# Altium schematic sheet COTS_Altimeter.SchDoc
size A3
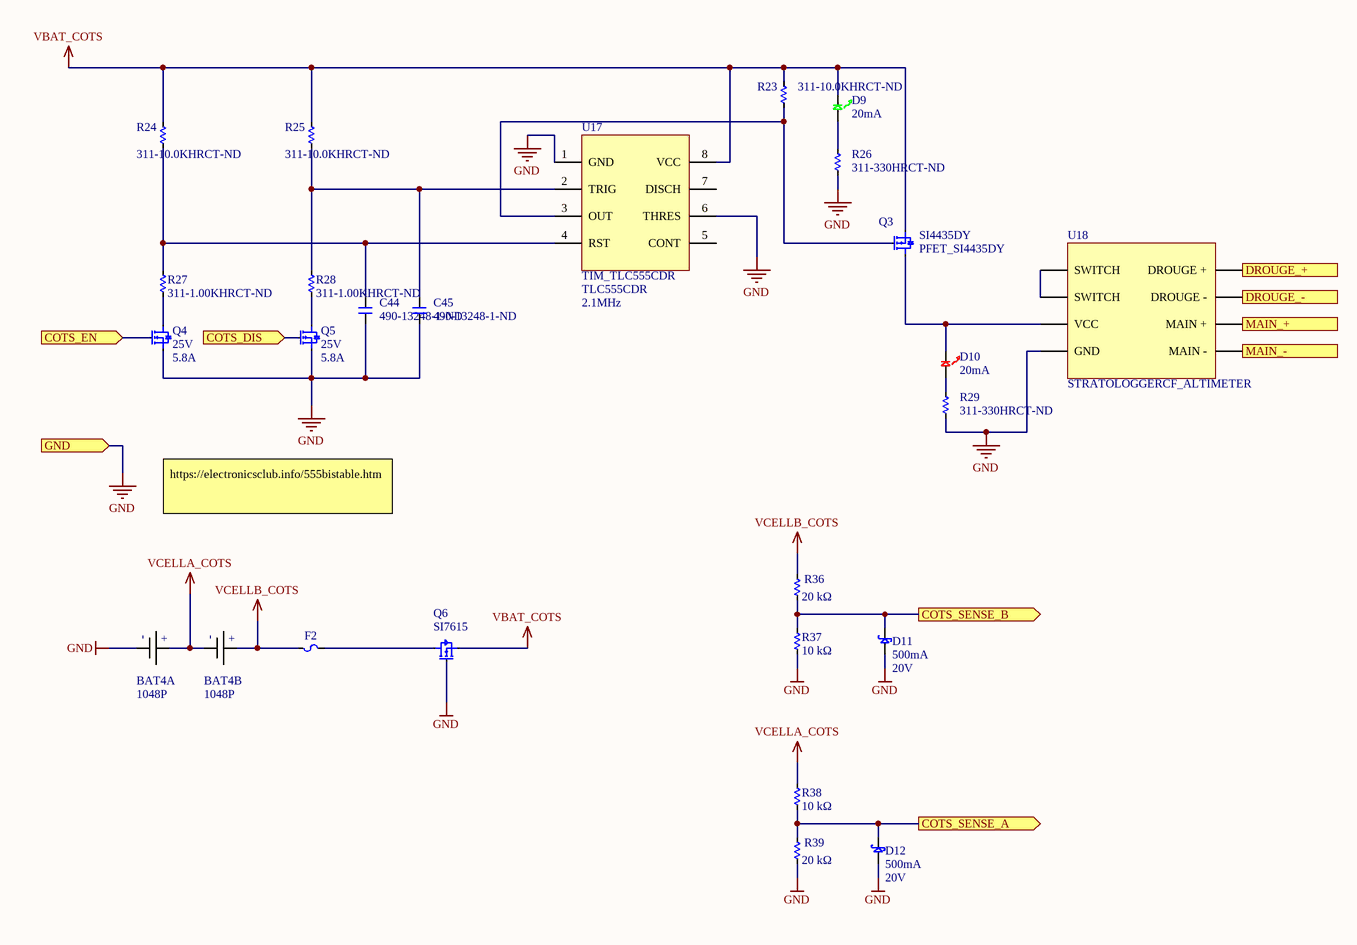
[diagram p0: COTS_Altimeter.SchDoc]

## Parts
BAT4  Manufacturer Part Number: 1048P  [BATT_18650_KEYSTONE_1048]  (hidden comment: BATT_Clip_Li-Ion_2x)  (parts A,B of 2)
C44  490-13248-1-ND  [C0603]
C45  490-13248-1-ND  [C0603]
D9  Current - Test: 20mA  [0805_Diode]  (hidden comment: LED_LY971)
D10  Current - Test: 20mA  [0805_Diode]  (hidden comment: LED_LY974)
D11  Current - Average Rectified (Io): 500mA  Voltage - DC Reverse (Vr) (Max): 20V  [SOD123]  (hidden comment: SCHOTTKY_MBR0520L)
D12  Current - Average Rectified (Io): 500mA  Voltage - DC Reverse (Vr) (Max): 20V  [SOD123]  (hidden comment: SCHOTTKY_MBR0520L)
F2  __template_fuse  [R1206]  (value not drawn)
Q3  PFET_SI4435DY  Manufacturer Part Number: SI4435DY  [8SOIC300]
Q4  Drain to Source Voltage (Vdss): 25V  Current - Continuous Drain (Id) @ 25° C: 5.8A  [3SOT23]  (hidden comment: NFET_IRFML8244TRPBF)
Q5  Drain to Source Voltage (Vdss): 25V  Current - Continuous Drain (Id) @ 25° C: 5.8A  [3SOT23]  (hidden comment: NFET_IRFML8244TRPBF)
Q6  SI7615  [POWERPAK_1212-8_SINGLE]
R23  311-10.0KHRCT-ND  [R0603]
R24  311-10.0KHRCT-ND  [R0603]
R25  311-10.0KHRCT-ND  [R0603]
R26  311-330HRCT-ND  [R0603]
R27  311-1.00KHRCT-ND  [R0603]
R28  311-1.00KHRCT-ND  [R0603]
R29  311-330HRCT-ND  [R0603]
R36  Resistance: 20 kΩ  [R0603]  (hidden comment: 311-20.0KHRCT-ND)
R37  Resistance: 10 kΩ  [R0603]  (hidden comment: 311-10.0KHRCT-ND)
R38  Resistance: 10 kΩ  [R0603]  (hidden comment: 311-10.0KHRCT-ND)
R39  Resistance: 20 kΩ  [R0603]  (hidden comment: 311-20.0KHRCT-ND)
U17  TIM_TLC555CDR  Manufacturer Part Number: TLC555CDR  Frequency: 2.1MHz  [8SOIC390]
U18  STRATOLOGGERCF_ALTIMETER  [STRATOLOGGER_ALTIMETER]

## Ports
COTS_DIS (in), COTS_EN (in), COTS_SENSE_A (out), COTS_SENSE_B (out), DROUGE_+ (out), DROUGE_- (out), GND (in), MAIN_+ (out), MAIN_- (out)

## Nets
GND: BAT4.CELL1- C44.2 C45.2 D11.1 D12.1 Q4.2 Q5.2 Q6.4 R26.1 R29.1 R37.1 R39.1 U17.1(GND) U17.6(THRES) U18.5(GND) ; port GND
VBAT_COTS: D9.1 Q3.1,2,3 Q6.1 R23.2 R24.2 R25.2 U17.8(VCC)
VCELLA_COTS: BAT4.CELL1+ BAT4.CELL2- R38.2
VCELLB_COTS: BAT4.CELL2+ F2.1 R36.2
COTS_DIS: Q5.1 ; port COTS_DIS
COTS_EN: Q4.1 ; port COTS_EN
COTS_SENSE_A: D12.2 R38.1 R39.2 ; port COTS_SENSE_A
COTS_SENSE_B: D11.2 R36.1 R37.2 ; port COTS_SENSE_B
DROUGE_+: U18.4(DROUGE_+) ; port DROUGE_+
DROUGE_-: U18.3(DROUGE_-) ; port DROUGE_-
MAIN_+: U18.2(MAIN_+) ; port MAIN_+
MAIN_-: U18.1(MAIN_-) ; port MAIN_-
NetC44_1: C44.1 R24.1 R27.2 U17.4(RST)
NetC45_1: C45.1 R25.1 R28.2 U17.2(TRIG)
NetD9_2: D9.2 R26.2
NetD10_1: D10.1 Q3.5,6,7,8 U18.6(VCC)
NetD10_2: D10.2 R29.2
NetF2_2: F2.2 Q6.5
NetQ3_4: Q3.4 R23.1 U17.3(OUT)
NetQ4_3: Q4.3 R27.1
NetQ5_3: Q5.3 R28.1
NetU18_7: U18.7(SWITCH) U18.8(SWITCH)

Not connected (* = marked no-connect by the designer): U17 5(CONT) 7(DISCH)

## Notes on the sheet
- https://electronicsclub.info/555bistable.htm
- (in symbol CMP-030-0028-1, part A) +
- (in symbol CMP-030-0028-1, part B) +

## Library data of the parts
BAT4 = CMP-030-0028-1: Dual Lithium Ion Cell Holder; Manufacturer: Keystone Electronics; Number of Cells: 2; Battery Type, Function: Cylindrical, Holder; Battery Cell Size: 18650; Style: Holder (Open); ComponentLink1URL: http://www.keyelco.com/product-pdf.cfm?p=13959; Battery Series: -; RoHS: RoHS Compliant; Height Above Board: 0.585" (14.86mm); Design Item ID: BATT_Clip_Li-Ion_2x; Mounting Type: PCB, Surface Mount; Termination Style: SMD (SMT) Tab; Source: connector.SchLib; Stock 1: 759; Pricing 1: 1=4.81, 10=4.007, 50=3.506, 100=3.339, 250=2.92164, 500=2.83816, 1000=2.42078, 2500=2.25382, 5000=2.24047 (USD); ComponentLink1Description: http://www.keyelco.com/product-pdf.cfm?p=13959; Operating Temperature: -50°C ~ 145°C
C44 C45 = CMP-119-0071-1: CAP CER 10UF 35V X5R 0603 20%; Manufacturer: Murata Electronics North America; Capacitance - pF (Machine readable): #NAME?; Capacitance (shorthand): 10µF; Rated Voltage: 35V; Dielectric: X5R
D9 = CMP-033-0000-1: LED 0805 GREEN 20MA; Manufacturer Part Number: LG R971-KN-1; Manufacturer: OSRAM Opto Semiconductors Inc; Lens Color: White; Wavelength - Peak: 572nm; Lens Style/Size: Rectangle with Flat Top, 1.30mm x 1.25mm; Voltage - Forward (Vf) (Typ): 2.2V; Lens Transparency: Diffused; Wavelength - Dominant: 570nm; Millicandela Rating: 26.05mcd; Viewing Angle: 160°; Source: diode.SchLib; RoHS: RoHS Compliant; ComponentLink1URL: http://www.osram-os.com/Graphics/XPic9/00078860_0.pdf; Mounting Type: Surface Mount; ComponentLink1Description: http://www.osram-os.com/Graphics/XPic9/00078860_0.pdf; Packaging: Cut Tape (CT); Supplier Device Package: *; Package / Case: 0805 (2012 Metric); Design Item ID: LED_LY971; Size / Dimension: 2.00mm L x 1.25mm W; Pricing 1: 1=0.08, 10=0.069, 100=0.0548, 250=0.04796, 500=0.04384 (USD); Stock 1: 89733; Height (Max): 0.80mm; Color: Green
D10 = CMP-033-0001-1: LED 0805 RED 20MA; Manufacturer Part Number: LH R974-LP-1; Manufacturer: OSRAM Opto Semiconductors Inc; Millicandela Rating: 41mcd; Lens Style/Size: Rectangle with Flat Top, 1.30mm x 1.25mm; Wavelength - Peak: 660nm; Lens Transparency: Diffused; Wavelength - Dominant: 645nm; Viewing Angle: 160°; Voltage - Forward (Vf) (Typ): 1.8V; Lens Color: White; Mounting Type: Surface Mount; ComponentLink1Description: http://www.osram-os.com/Graphics/XPic8/00078869_0.pdf; Pricing 1: 1=0.08, 10=0.07, 100=0.0559, 250=0.04892, 500=0.04472 (USD); Packaging: Cut Tape (CT); Size / Dimension: 2.00mm L x 1.25mm W; Design Item ID: LED_LY974; Stock 1: 66379; Package / Case: 0805 (2012 Metric); ComponentLink1URL: http://www.osram-os.com/Graphics/XPic8/00078869_0.pdf; RoHS: RoHS Compliant; Color: Red; Supplier Device Package: *; Height (Max): 0.80mm; Source: diode.SchLib
D11 D12 = CMP-033-0037-1: DIODE SCHOTTKY 0.5A 20V SOD-123; Manufacturer: Fairchild Semiconductor; Speed: Fast Recovery =< 500ns, > 200mA (Io); Current - Reverse Leakage @ Vr: 250µA @ 20V; Voltage - Forward (Vf) (Max) @ If: 385mV @ 500mA; Manufacturer Part Number: MBR0520L; RoHS: RoHS Compliant; Stock 1: 217232; Pricing 1: 1=0.63, 10=0.43, 100=0.2024, 250=0.1442, 500=0.11006, 750=0.08603, 1000=0.0759 (USD); Diode Type: Schottky; Reverse Recovery Time (trr): -; Capacitance @ Vr, F: -; Mounting Type: Surface Mount; Package / Case: SOD-123; Supplier Device Package: SOD-123; Packaging: Cut Tape (CT); ComponentLink1URL: http://www.fairchildsemi.com/ds/MB/MBR0520L.pdf; ComponentLink1Description: Datasheet; Design Item ID: SCHOTTKY_MBR0520L; Source: diode.SchLib
F2 = CMP-035-0003-1: Source: fuse.SchLib; Design Item ID: __template_fuse
Q3 = CMP-078-0013-1: MOSFET P-CH 30V 8.8A; Manufacturer: Fairchild Semiconductor; Drain to Source Resistance: 20mR; Current Rating: -8.8A; Fall Time: 25ns; Number of Elements: 1; Nominal Vgs: -1.7V; Turn-Off Delay Time: 42ns; Voltage Rating (DC): -30V; Max Power Dissipation: 2.5W; Rise Time: 13.5ns; Gate to Source Voltage (Vgs): 20V; Input Capacitance: 1.604nF; Element Configuration: Single; Turn-On Delay Time: 16ns; Length: 4.9mm; Case/Package: SOIC; Continuous Drain Current (ID): 8.8A; Lead Free: Lead Free; Stock 1: 5038; Width: 3.9mm; Pricing 1: 1=0.99, 10=0.884, 100=0.6893, 500=0.5694, 1000=0.4495 (USD); ComponentLink5Description: https://datasheet.ciiva.com/16772/si4435dy-16772219.pdf; ComponentLink1Description: https://datasheet.ciiva.com/4450/si4435dy-100561-4450691.pdf; ComponentLink7Description: https://datasheet.ciiva.com/6374/si4435dy-6374703.pdf; Threshold Voltage: -1.7V; Max Operating Temperature: 175°C; Package Quantity: 1; Packaging: Tape and Reel; Height: 1.57mm; ComponentLink3Description: https://datasheet.ciiva.com/26252/si4435dy-26252714.pdf; ComponentLink7URL: https://datasheet.ciiva.com/6374/si4435dy-6374703.pdf; Drain to Source Voltage (Vdss): 30V; Dual Supply Voltage: -30V; ComponentLink2Description: https://datasheet.ciiva.com/22682/256483-22682026.pdf; Radiation Hardening: No; Rds On Max: 20mR; REACH SVHC: No SVHC; ComponentLink3URL: https://datasheet.ciiva.com/26252/si4435dy-26252714.pdf; ComponentLink6URL: https://datasheet.ciiva.com/6374/si4435dy-6374700.pdf; ComponentLink4Description: https://datasheet.ciiva.com/11175/si4435dy-11175899.pdf; ComponentLink4URL: https://datasheet.ciiva.com/11175/si4435dy-11175899.pdf; ComponentLink2URL: https://datasheet.ciiva.com/22682/256483-22682026.pdf; Source: transistor_fet.SchLib; ComponentLink6Description: https://datasheet.ciiva.com/6374/si4435dy-6374700.pdf; Number of Pins: 8; ComponentLink5URL: https://datasheet.ciiva.com/16772/si4435dy-16772219.pdf; Drain to Source Breakdown Voltage: -30V; Power Dissipation: 2.5W; Mount: Surface Mount; ComponentLink1URL: https://datasheet.ciiva.com/4450/si4435dy-100561-4450691.pdf; Termination: SMD/SMT; Design Item ID: PFET_SI4435DY; Min Operating Temperature: -55°C
Q4 Q5 = CMP-078-0046-1: MOSFET N-CH 25V 5.8A SOT23; Manufacturer: International Rectifier; FET Type: MOSFET N-Channel, Metal Oxide; FET Feature: Logic Level Gate; Rds On (Max) @ Id, Vgs: 24 mOhm @ 5.8A, 10V; Vgs(th) (Max) @ Id: 2.35V @ 10µA; Gate Charge (Qg) @ Vgs: 5.4nC @ 10V; Input Capacitance (Ciss) @ Vds: 430pF @ 10V; Power - Max: 1.25W; Manufacturer Part Number: IRFML8244TRPBF; RoHS: RoHS Compliant; Stock 1: 13542; Pricing 1: 1=0.41, 10=0.23, 100=0.1491, 250=0.13548, 500=0.1219, 1000=0.11411 (USD); Mounting Type: Surface Mount; Package / Case: TO-236-3, SC-59, SOT-23-3; Supplier Device Package: SOT-23; Packaging: Cut Tape (CT); ComponentLink1URL: http://www.irf.com/product-info/datasheets/data/irfml8244pbf.pdf; ComponentLink1Description: Datasheet; Design Item ID: NFET_IRFML8244TRPBF; Source: transistor_fet.SchLib
Q6 = CMP-078-0043-2: MOSFET P-CH 20V 35A PPK; Manufacturer: Vishay Siliconix; Manufacturer Part Number: SI7615ADN-T1-GE3; FET Type: MOSFET P-Channel, Metal Oxide; FET Feature: Standard; Current - Continuous Drain (Id) @ 25°C: 35A (Tc); Rds On (Max) @ Id, Vgs: 4.4 mOhm @ 20A, 10V; Vgs(th) (Max) @ Id: 1.5V @ 250µA; Gate Charge (Qg) @ Vgs: 183nC @ 10V; Input Capacitance (Ciss) @ Vds: 5590pF @ 10V; Power - Max: 52W; RoHS: RoHS Compliant; Stock 1: 98451; Pricing 1: 1=0.73, 10=0.646, 25=0.6068, 100=0.4951, 250=0.45988, 500=0.3914, 1000=0.31312 (USD); Packaging: Cut Tape (CT); Part Status: Active; Drain to Source Voltage (Vdss): 20V; Operating Temperature: -55°C ~ 150°C (TJ); Mounting Type: Surface Mount; Package / Case: PowerPAK® 1212-8; Supplier Device Package: PowerPAK® 1212-8; ComponentLink1URL: http://www.vishay.com/docs/62667/si7615adn.pdf; ComponentLink1Description: http://www.vishay.com/docs/62667/si7615adn.pdf; Source: transistor_fet.SchLib; Design Item ID: PFET_SI7615ADN-T1
R23-R25 = CMP-126-0273-2: RES SMD 10K OHM 1% 1/10W 0603; Manufacturer Part Number: RC0603FR-0710KL; Manufacturer: Yageo; Power (Watts): 0.1W, 1/10W; Temperature Coefficient: ±100ppm/°C; Resistance: 10 kΩ; Resistance (Sortable): 10000; Tolerance: ±1%; Operating Temperature: -55°C ~ 155°C; Datasheets: http://www.yageo.com/documents/recent/PYu-RC_Group_51_RoHS_L_9.pdf; Image: //media.digikey.com/Renders/Yageo%20Renders/0603-(1608-Metric).jpg
R26 R29 = CMP-126-0120-2: RES SMD 330 OHM 1% 1/10W 0603; Manufacturer: Yageo; Manufacturer Part Number: RC0603FR-07330RL; Temperature Coefficient: ±100ppm/°C; Resistance (Sortable): 330; Resistance: 330 Ω; Power (Watts): 0.1W, 1/10W; Tolerance: ±1%; Datasheets: http://www.yageo.com/documents/recent/PYu-RC_Group_51_RoHS_L_9.pdf; Operating Temperature: -55°C ~ 155°C; Image: //media.digikey.com/Renders/Yageo%20Renders/0603-(1608-Metric).jpg
R27 R28 = CMP-126-0172-2: RES SMD 1K OHM 1% 1/10W 0603; Manufacturer: Yageo; Manufacturer Part Number: RC0603FR-071KL; Power (Watts): 0.1W, 1/10W; Resistance (Sortable): 1000; Resistance: 1 kΩ; Temperature Coefficient: ±100ppm/°C; Image: //media.digikey.com/Renders/Yageo%20Renders/0603-(1608-Metric).jpg; Operating Temperature: -55°C ~ 155°C; Tolerance: ±1%; Datasheets: http://www.yageo.com/documents/recent/PYu-RC_Group_51_RoHS_L_9.pdf
R36 R39 = CMP-126-0304-2: RES SMD 20K OHM 1% 1/10W 0603; Manufacturer Part Number: RC0603FR-0720KL; Manufacturer: Yageo; Resistance (Sortable): 20000; Power (Watts): 0.1W, 1/10W; Temperature Coefficient: ±100ppm/°C; Datasheets: http://www.yageo.com/documents/recent/PYu-RC_Group_51_RoHS_L_9.pdf; Image: //media.digikey.com/Renders/Yageo%20Renders/0603-(1608-Metric).jpg; Tolerance: ±1%; Operating Temperature: -55°C ~ 155°C
R37 R38 = CMP-126-0273-2: RES SMD 10K OHM 1% 1/10W 0603; Manufacturer Part Number: RC0603FR-0710KL; Manufacturer: Yageo; Resistance (Sortable): 10000; Power (Watts): 0.1W, 1/10W; Temperature Coefficient: ±100ppm/°C; Datasheets: http://www.yageo.com/documents/recent/PYu-RC_Group_51_RoHS_L_9.pdf; Image: //media.digikey.com/Renders/Yageo%20Renders/0603-(1608-Metric).jpg; Tolerance: ±1%; Operating Temperature: -55°C ~ 155°C
U17 = CMP-059-0002-1: 555 Type, Timer/Oscillator (Single) IC 2.1MHz 8-SOIC (0.154", 3.90mm Width); Manufacturer: Texas Instruments; Current - Supply: 360µA; Voltage - Supply: 2 V ~ 15 V; Package / Case: 8-SOIC (0.154", 3.90mm Width); ComponentLink1Description: http://www.ti.com/lit/ds/symlink/tlc555.pdf; Mounting Type: Surface Mount; ComponentLink1URL: http://www.ti.com/lit/ds/symlink/tlc555.pdf; Operating Temperature: 0°C ~ 70°C; Design Item ID: TIM_TLC555CDR; Stock 1: 16901; Source: miscellaneous.SchLib; Count: -; Part Status: Active; Supplier Device Package: 8-SOIC; Packaging: Cut Tape (CT); Pricing 1: 1=0.72, 10=0.629, 100=0.481, 500=0.3811, 1000=0.30525 (USD); RoHS: RoHS Compliant
U18 = CMP-064-0039-2: Stratologger; Source: modules.SchLib; Design Item ID: STRATOLOGGERCF_ALTIMETER